# EAGLE schematic lab10 (EAGLE 9.6.2)
Fall 2021 EE445L This is the baseline schematic
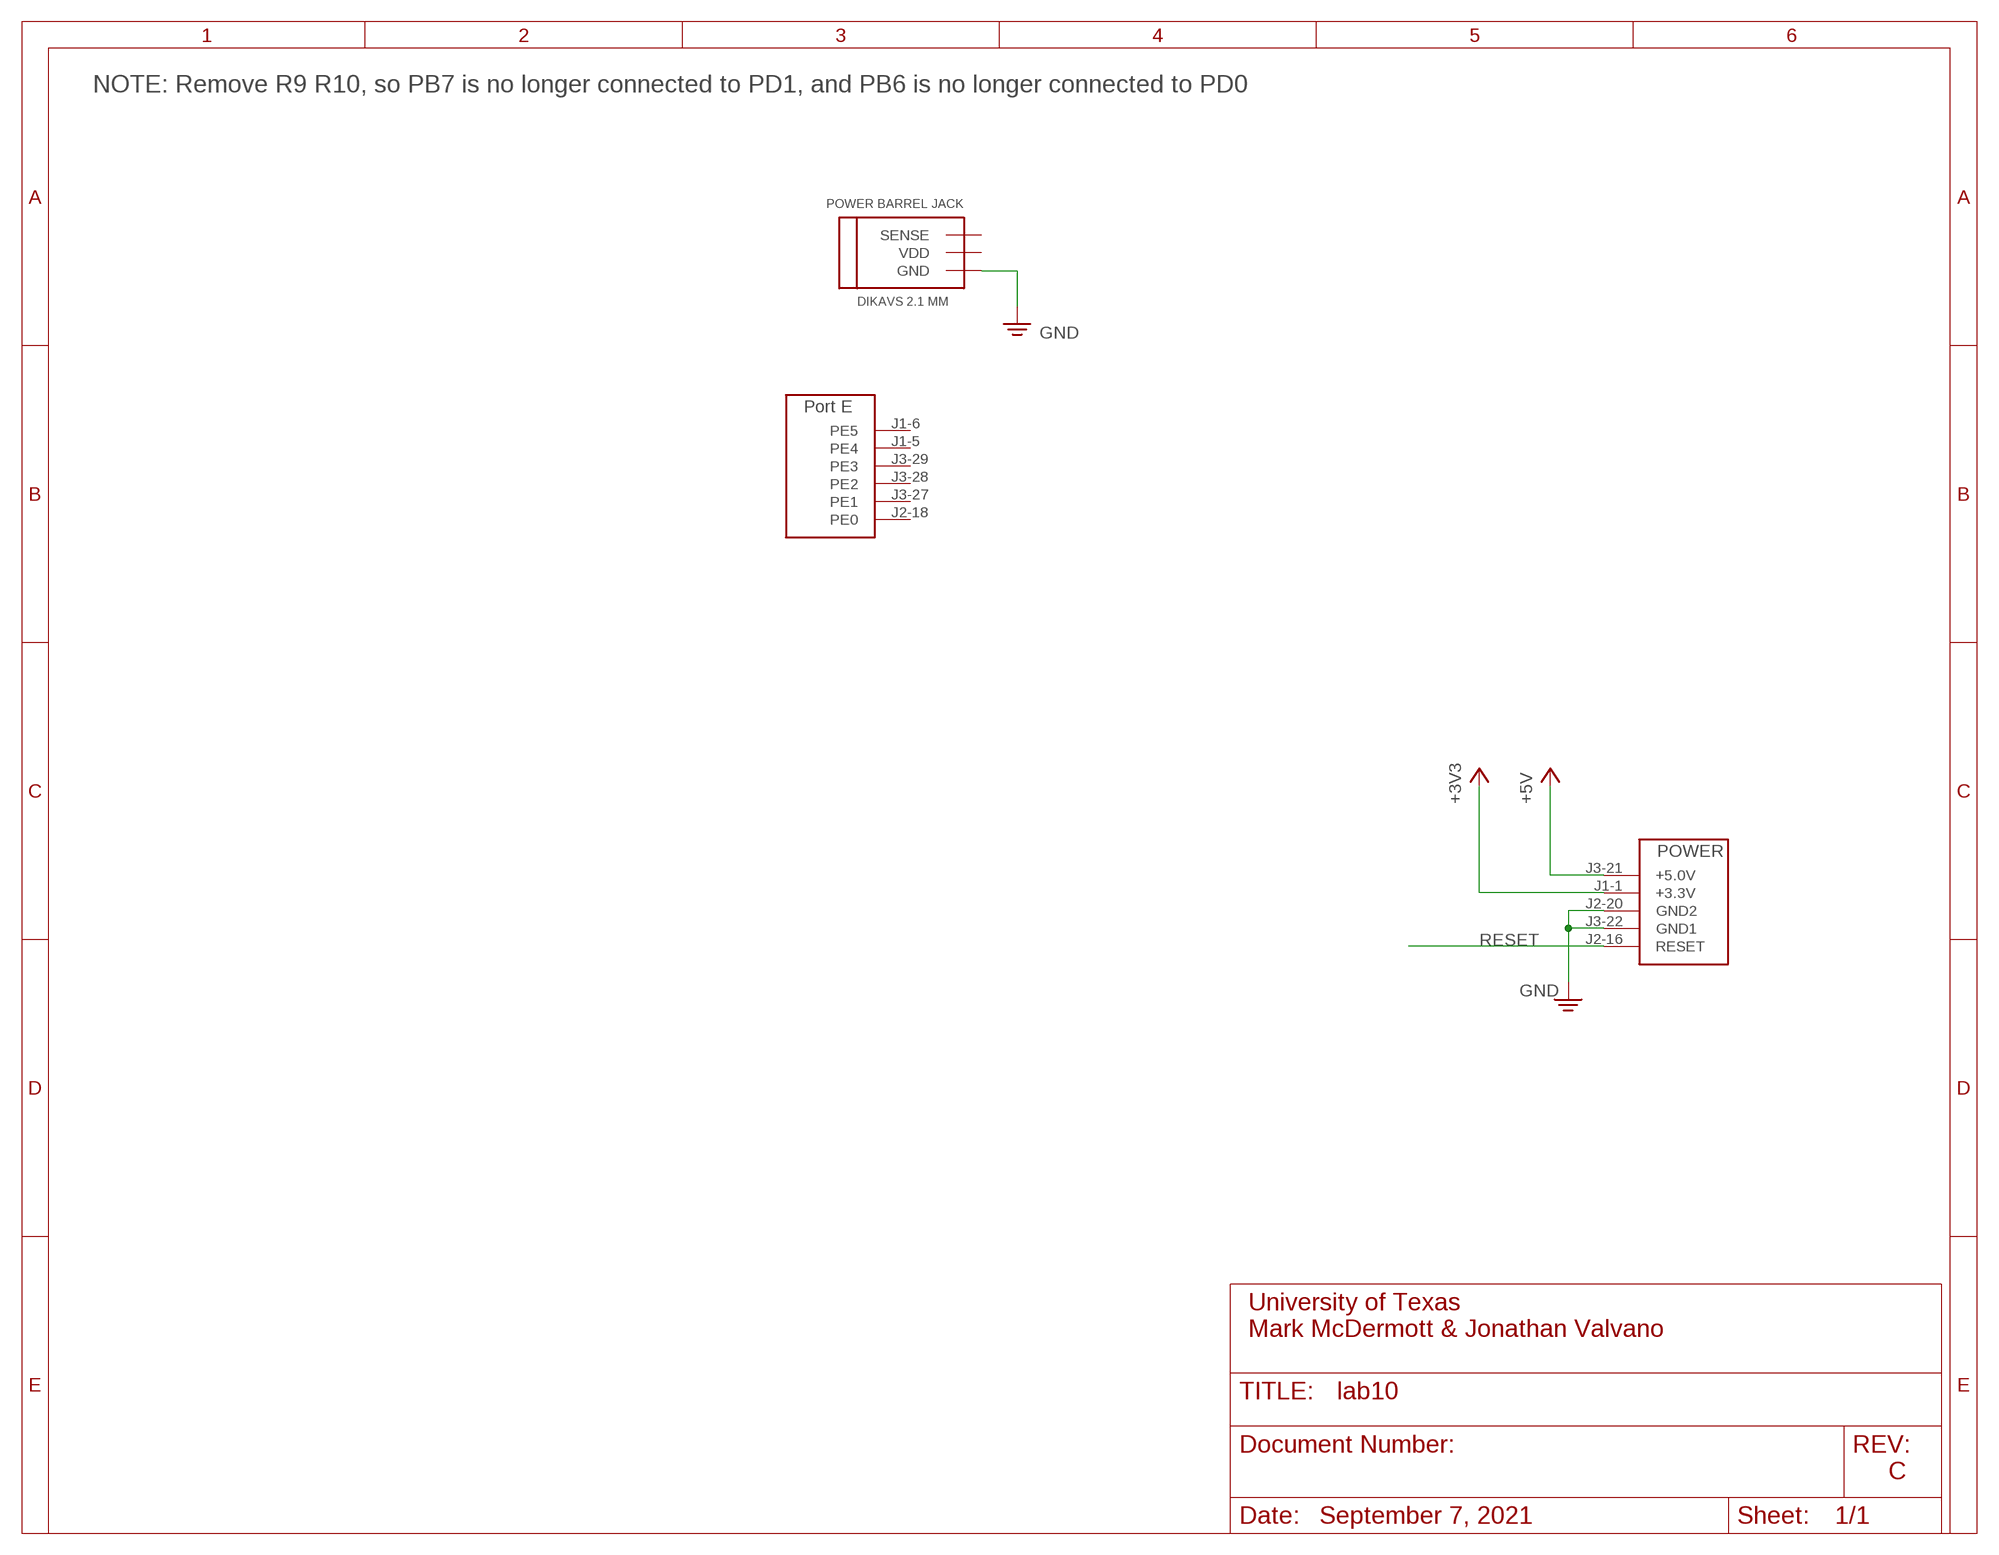
[diagram p0: schematic, sheet 1, part 1 of 2]
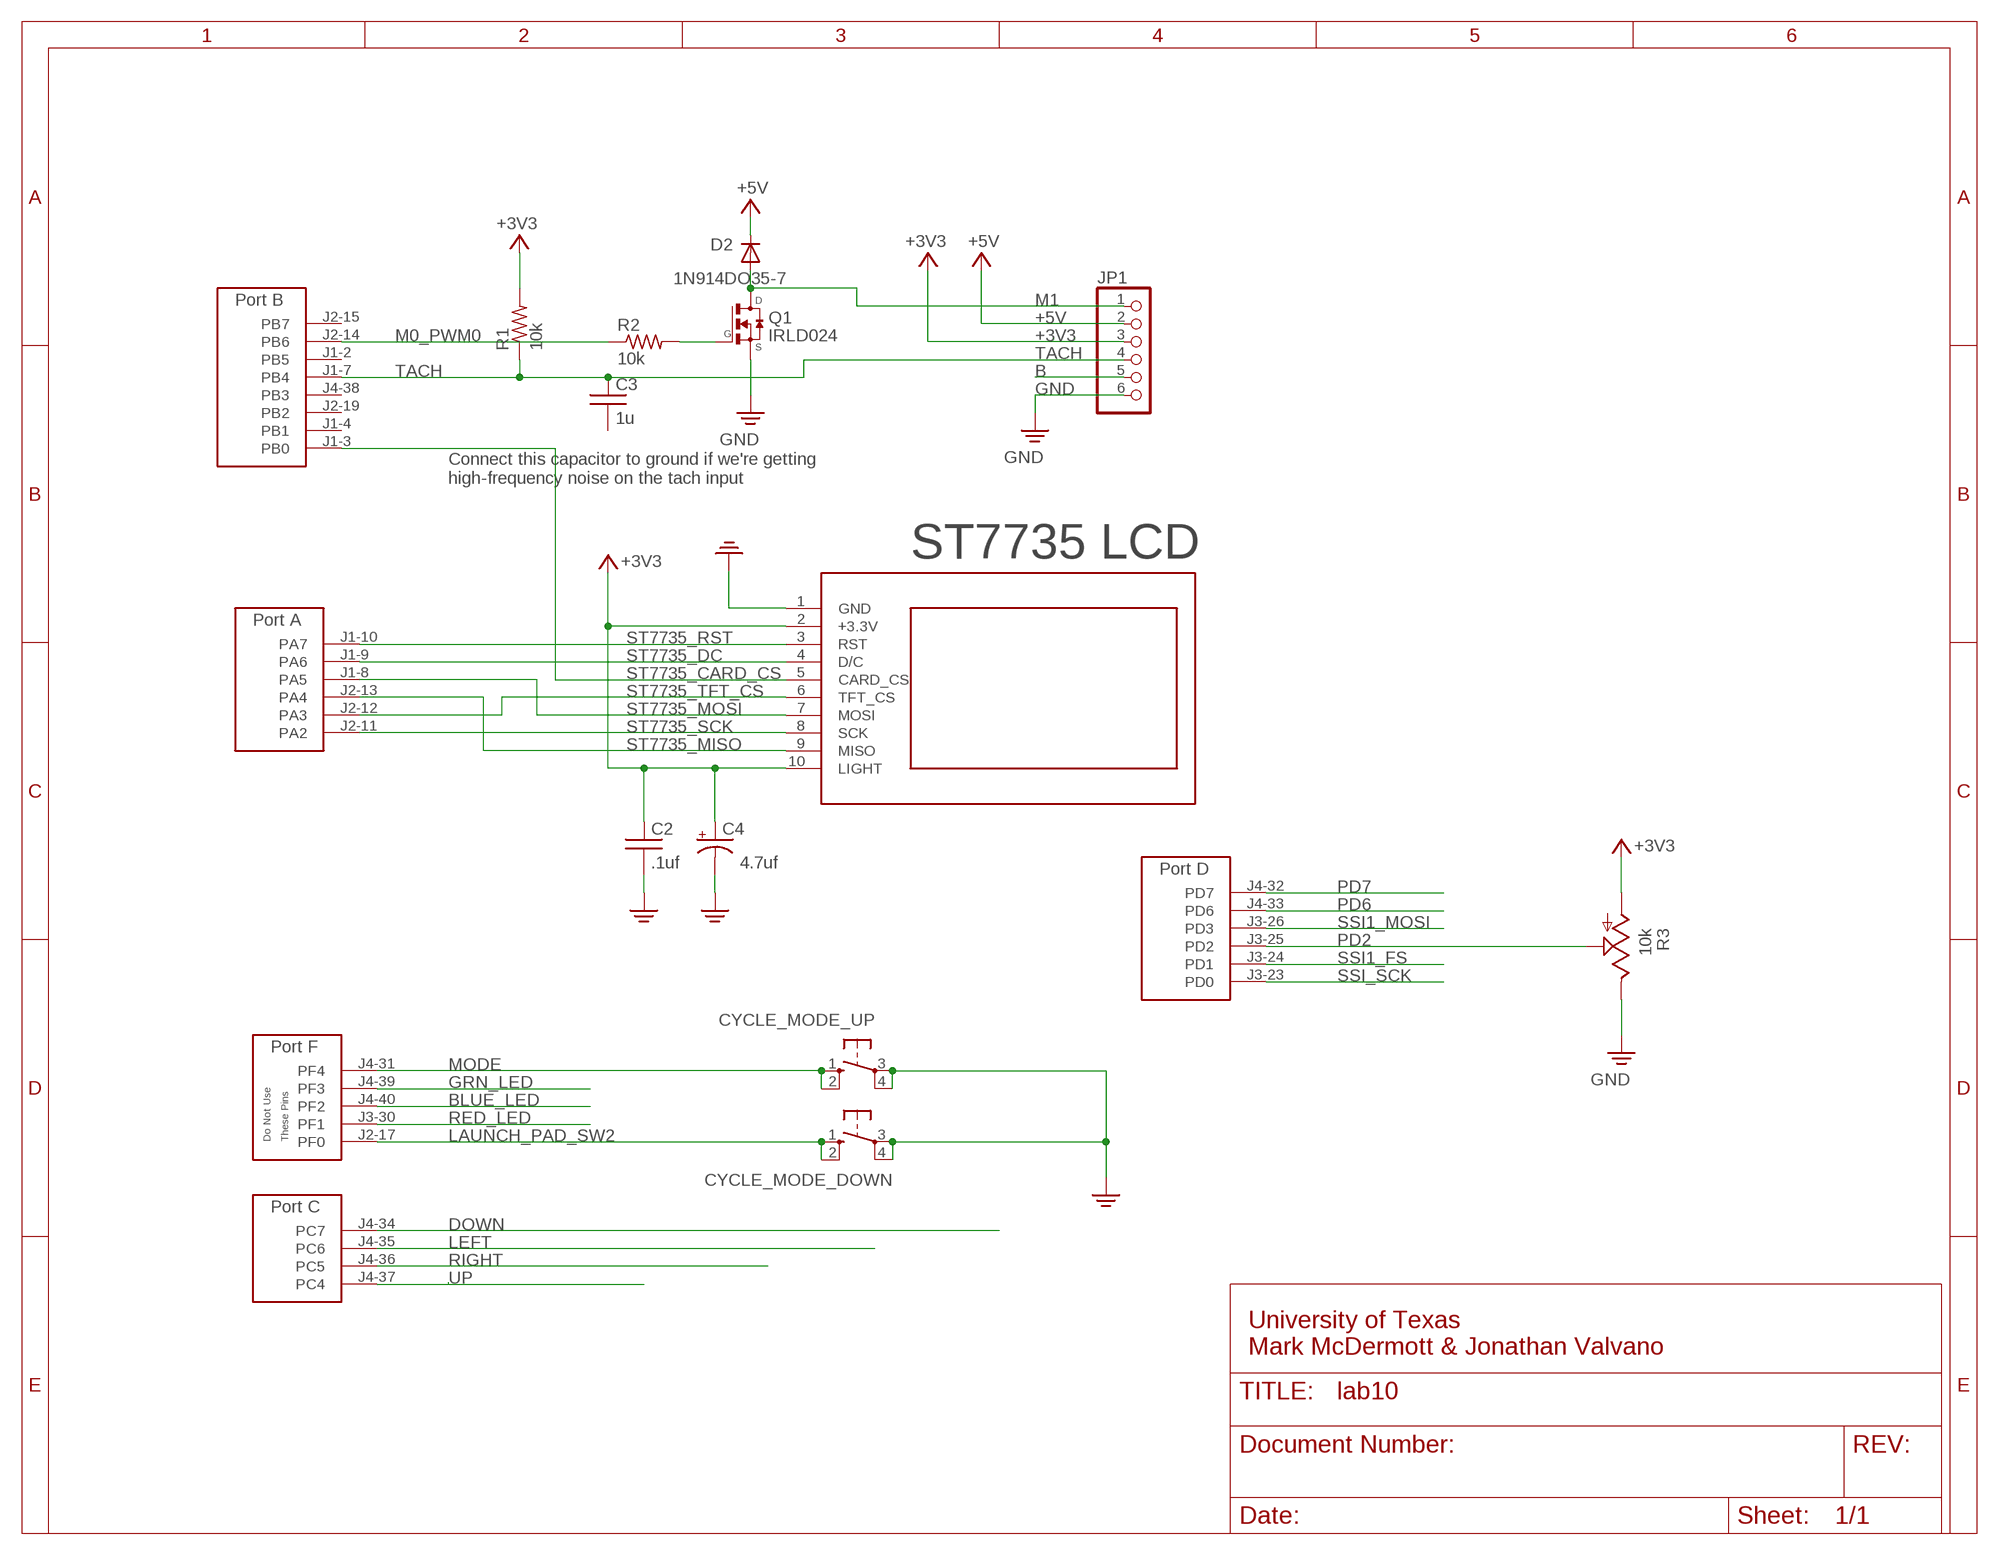
[diagram p1: schematic, sheet 1, part 2 of 2]

## Parts
C2  .1uf  CAPACITOR050-024X044  [CAP200MIL]
C3  1u  CAPACITOR025-024X044  [CAP100MIL]
C4  4.7uf  CAPACITOR_POLARIZEDE5-6  [CAP200MILPOLARIZED]
CYCLE_MODE_DOWN  B3F-1052  [B3F-10XX]
CYCLE_MODE_UP  B3F-1052  [B3F-10XX]
D2  1N914DO35-7  [DO35-7]
JP1  PINHD-1X6  [1X06]
Q1  IRLD024  [IRLD024]
R1  10k  RESISTOR0204/7  [RES300MIL]
R2  10k  RESISTOR0204/7  [RES300MIL]
R3  10k  POTENTIOMETER_PTA2043B25U  [PTA2043]
U$2  TM4C_BP  [TM4C_BOOSTER_PACK]
U$3  ST7735  [ST7735]
U$4  2.1MM_BARREL_JACK  [2.1M_BARREL_JACK]

## Nets
+3V3: C2.1 C4.+ JP1.3 R1.2 R3.3(A) U$2.J1-1(+3.3V) U$3.2(+3.3V) U$3.10(LIGHT)
+5V: D2.C JP1.2 U$2.J3-21(+5.0V)
B: JP1.5
BLUE_LED: U$2.J4-40(PF2)
DOWN: U$2.J4-34(PC7)
GND: C2.2 C4.- CYCLE_MODE_DOWN.3(P) CYCLE_MODE_DOWN.4(P1) CYCLE_MODE_UP.3(P) CYCLE_MODE_UP.4(P1) JP1.6 Q1.P$4(S) R3.1(E) U$2.J2-20(GND2) U$2.J3-22(GND1) U$3.1(GND) U$4.GND
GRN_LED: U$2.J4-39(PF3)
LAUNCH_PAD_SW2: CYCLE_MODE_DOWN.1(S) CYCLE_MODE_DOWN.2(S1) U$2.J2-17(PF0)
LEFT: U$2.J4-35(PC6)
M0_PWM0: R2.1 U$2.J2-14(PB6)
M1: D2.A JP1.1 Q1.P$1(D)
MODE: CYCLE_MODE_UP.1(S) CYCLE_MODE_UP.2(S1) U$2.J4-31(PF4)
N$1: Q1.P$3(G) R2.2
PD2: R3.2(S) U$2.J3-25(PD2)
PD6: U$2.J4-33(PD6)
PD7: U$2.J4-32(PD7)
RED_LED: U$2.J3-30(PF1)
RESET: U$2.J2-16(RESET)
RIGHT: U$2.J4-36(PC5)
SSI1_FS: U$2.J3-24(PD1)
SSI1_MOSI: U$2.J3-26(PD3)
SSI_SCK: U$2.J3-23(PD0)
ST7735_CARD_CS: U$2.J1-3(PB0) U$3.5(CARD_CS)
ST7735_DC: U$2.J1-9(PA6) U$3.4(D/C)
ST7735_MISO: U$2.J2-13(PA4) U$3.9(MISO)
ST7735_MOSI: U$2.J1-8(PA5) U$3.7(MOSI)
ST7735_RST: U$2.J1-10(PA7) U$3.3(RST)
ST7735_SCK: U$2.J2-11(PA2) U$3.8(SCK)
ST7735_TFT_CS: U$2.J2-12(PA3) U$3.6(TFT_CS)
TACH: C3.1 JP1.4 R1.1 U$2.J1-7(PB4)
UP: U$2.J4-37(PC4)
Unconnected: C3.2 U$2.J1-2(PB5) U$2.J1-4(PB1) U$2.J1-5(PE4) U$2.J1-6(PE5) U$2.J2-15(PB7) U$2.J2-18(PE0) U$2.J2-19(PB2) U$2.J3-27(PE1) U$2.J3-28(PE2) U$2.J3-29(PE3) U$2.J4-38(PB3) U$4.SENSE U$4.VDD

## Notes on the sheet
- NOTE: Remove R9 R10, so PB7 is no longer connected to PD1, and PB6 is no longer connected to PD0
- Connect this capacitor to ground if we're getting 
  high-frequency noise on the tach input
- ST7735 LCD
- University of Texas
  Mark McDermott & Jonathan Valvano
- University of Texas
  Mark McDermott & Jonathan Valvano
- C
- September 7, 2021

## Library data of the parts
C2 C3 = EE445L:CAPACITOR: CAPACITOR, American symbol
C4 = EE445L:CAPACITOR_POLARIZED: POLARIZED CAPACITOR, American symbol
CYCLE_MODE_DOWN CYCLE_MODE_UP = EE445L:B3F-1052: OMRON SWITCH 1.1mm holes; MPN: B3F-1000; OC_FARNELL: 176432; OC_NEWARK: 36M3542
D2 = EE445L:1N914: DIODE high speed (Philips) 1N914
JP1 = EE445L:PINHD-1X6: PIN HEADER
Q1 = EE445L:IRLD024: N-Channel Enhancement MOSFET
R1 R2 = EE445L:RESISTOR: RESISTOR, American symbol
R3 = EE445L:POTENTIOMETER_PTA2043: POTENTIOMETER Warning There are many many sizes and shapes of potentiometers. Please verify both the wiring and the physical layout of your pots.
U$2 = EE445L:TM4C_BP
U$3 = EE445L:ST7735
U$4 = EE445L:2.1MM_BARREL_JACK